# EAGLE design controller-terminals (EAGLE 5.04)
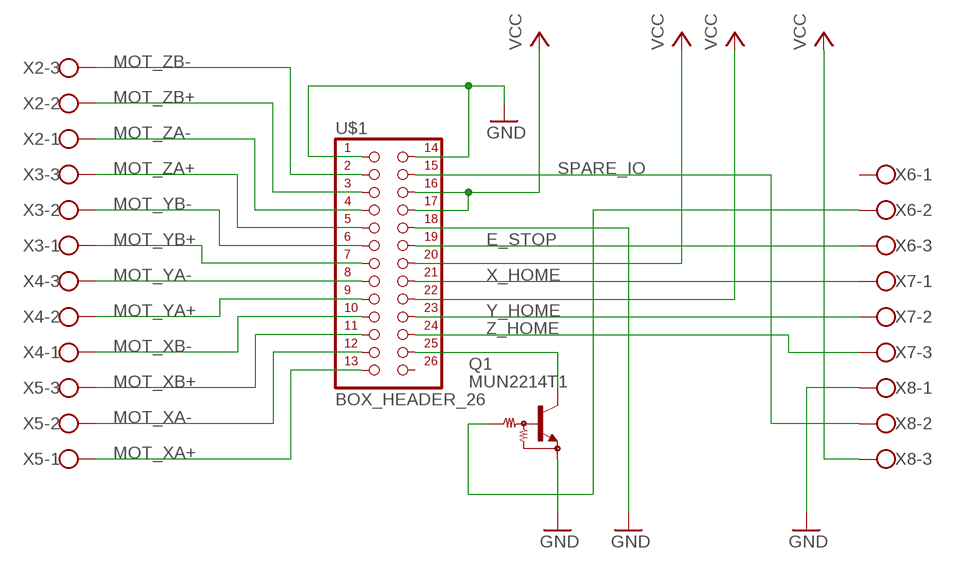
[diagram p0: schematic, sheet 1]

## Parts
Q1  MUN2214T1  [SC59-BEC]
U$1  BOX_HEADER_26  [BOX_HEADER_26]
X2  W237-03P  [W237-133]
X3  W237-03P  [W237-133]
X4  W237-03P  [W237-133]
X5  W237-03P  [W237-133]
X6  W237-03P  [W237-133]
X7  W237-03P  [W237-133]
X8  W237-03P  [W237-133]

## Nets
E_STOP: U$1.P$19 X6.3
GND: Q1.E U$1.P$1 U$1.P$14 U$1.P$18 X8.1
MOT_XA+: U$1.P$13 X5.1
MOT_XA-: U$1.P$12 X5.2
MOT_XB+: U$1.P$11 X5.3
MOT_XB-: U$1.P$10 X4.1
MOT_YA+: U$1.P$9 X4.2
MOT_YA-: U$1.P$8 X4.3
MOT_YB+: U$1.P$7 X3.1
MOT_YB-: U$1.P$6 X3.2
MOT_ZA+: U$1.P$5 X3.3
MOT_ZA-: U$1.P$4 X2.1
MOT_ZB+: U$1.P$3 X2.2
MOT_ZB-: U$1.P$2 X2.3
N$1: Q1.C U$1.P$25
N$2: Q1.B X6.2
SPARE_IO: U$1.P$15 X8.2
VCC: U$1.P$16 U$1.P$17 U$1.P$20 U$1.P$22 X8.3
X_HOME: U$1.P$21 X7.1
Y_HOME: U$1.P$23 X7.2
Z_HOME: U$1.P$24 X7.3
Unconnected: U$1.P$26 X6.1

## Library data of the parts
Q1 = transistor-npn:MUN2214*: NPN Bias Resistor Transistor
U$1 = box-headers:BOX_HEADER_26
X2-X8 = con-wago-508:W237-03P: WAGO SREW CLAMP

## Board
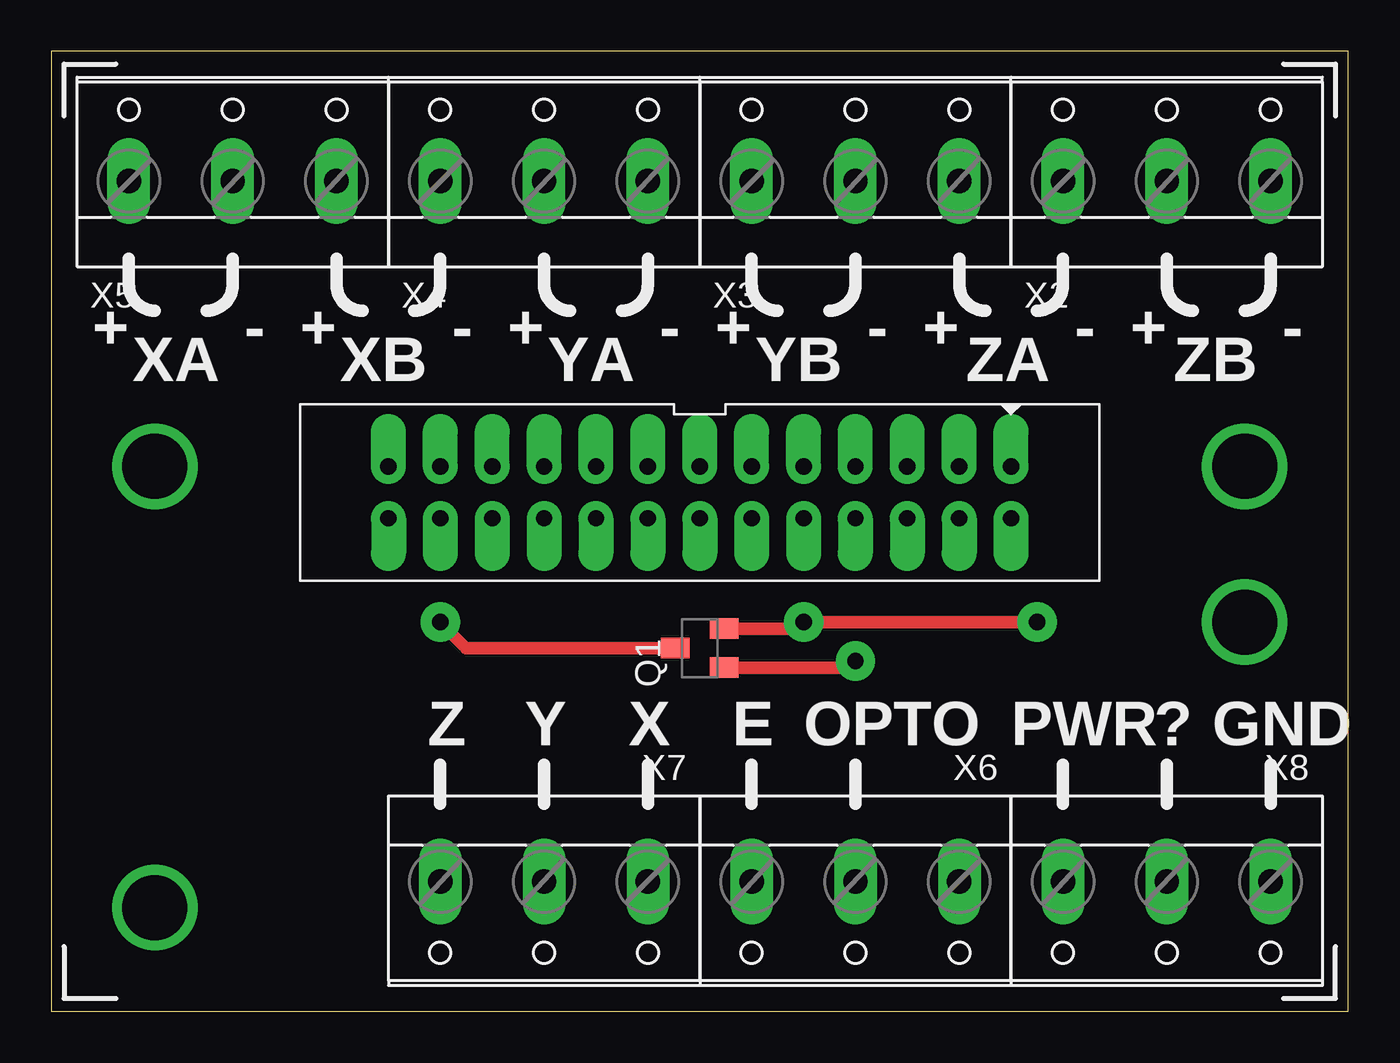
[diagram p1: board, top side]
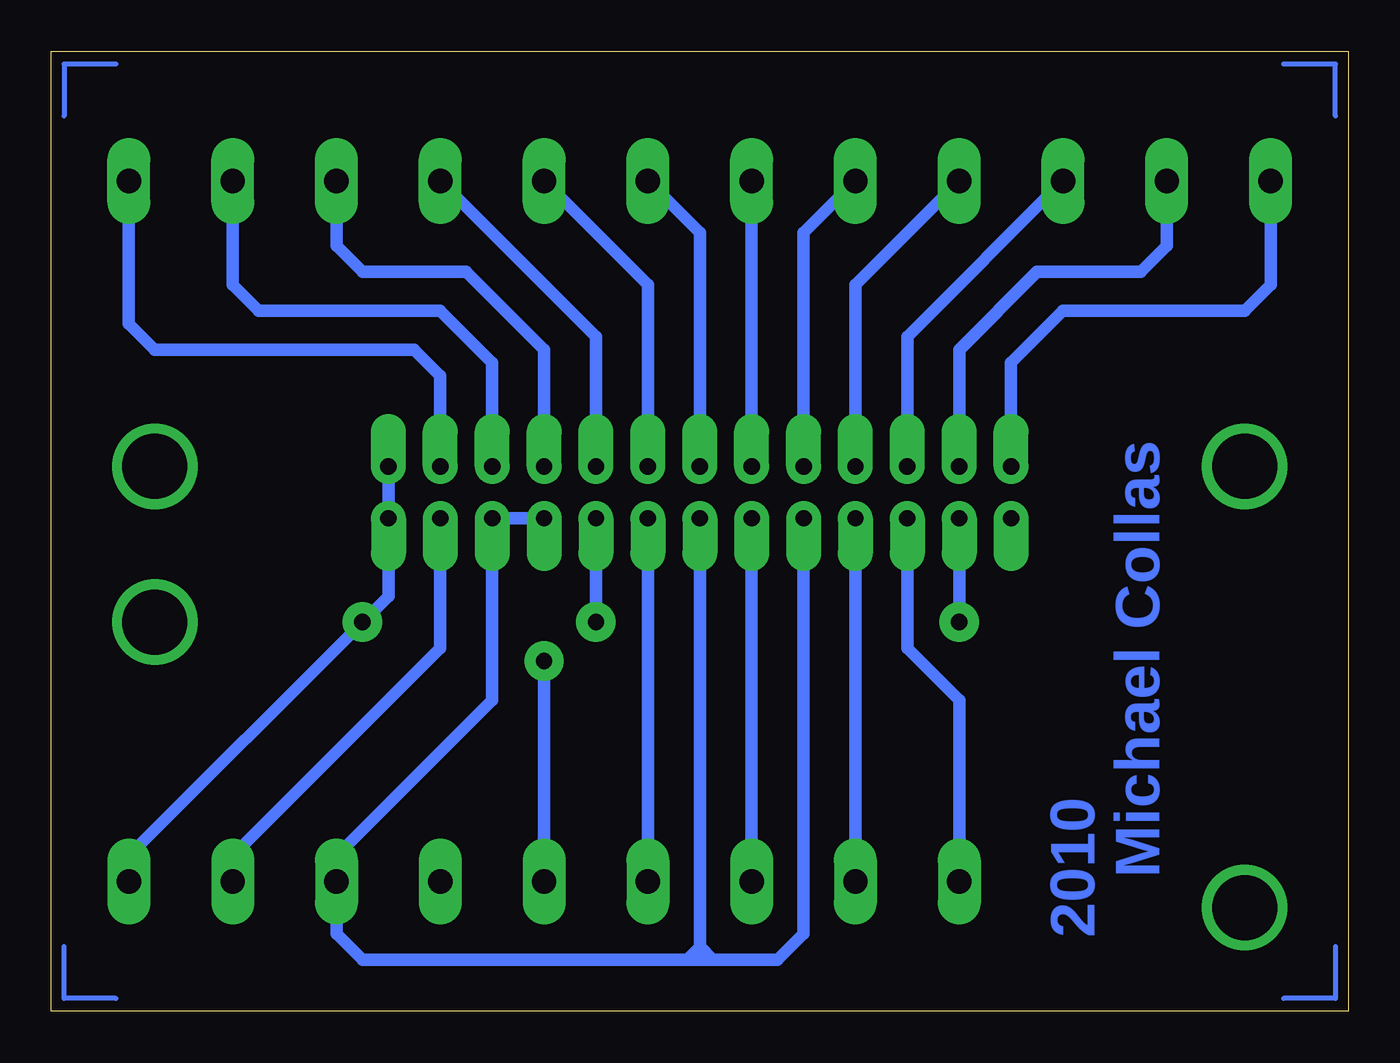
[diagram p2: board, bottom side, seen from below]

Size 63.5 x 46.99 mm. Coordinates in mm from the lower left corner, seen from the top.
Outline: 0,0 63.5,0 63.5,46.99 0,46.99 0,0
Copper layers (1*16): Top 0.035mm / dielectric 1.5mm / Bottom 0.035mm
Design rules "default *": minimum track width 12mil, minimum drill 24mil, track to track 18mil, track to pad 18mil, pad to pad 16mil, via to via 16mil, smd to smd 8mil, copper to edge 40mil, drill to drill 8mil, minimum pad ring 18mil, minimum via ring 8mil, stop-mask expansion 4mil, vias tented up to drill 0mil, thermal gap 10mil

### Footprints (pad centres in the part's own frame; a part is rotated, then mirrored left to right if it is on the bottom)
SC59-BEC = smd 1 x 1.4: B -0.95,-1.2; C 0,1.2; E 0.95,-1.2
BOX_HEADER_26 = drill 0.8 offset: P$1 15.24,1.27; P$2 12.7,1.27; P$3 10.16,1.27; P$4 7.62,1.27; P$5 5.08,1.27; P$6 2.54,1.27; P$7 0,1.27; P$8 -2.54,1.27; P$9 -5.08,1.27; P$10 -7.62,1.27; P$11 -10.16,1.27; P$12 -12.7,1.27; P$13 -15.24,1.27; P$14 15.24,-1.27; P$15 12.7,-1.27; P$16 10.16,-1.27; P$17 7.62,-1.27; P$18 5.08,-1.27; P$19 2.54,-1.27; P$20 0,-1.27; P$21 -2.54,-1.27; P$22 -5.08,-1.27; P$23 -7.62,-1.27; P$24 -10.16,-1.27; P$25 -12.7,-1.27; P$26 -15.24,-1.27
W237-133 = drill 1.194 long: 1 -5.08,-0.635; 2 0,-0.635; 3 5.08,-0.635

### Placement (x,y rotation side)
Q1  31.75,17.78 90 top
U$1  31.75,25.4 0 top
X2  54.61,41.27 0 top
X3  39.37,41.27 0 top
X4  24.13,41.27 0 top
X5  8.89,41.27 0 top
X6  39.37,5.71 180 top
X7  24.13,5.71 180 top
X8  54.61,5.71 180 top

### Tracks (layer width: path | path; a pad name or v marks a point on that pad's centre or on a via)
E_STOP
  Bottom 0.61: X6.3 U$1.P$19
GND  (via drill 0.8 pad 1.93)
  Top 0.61: Q1.E 36.51,18.73 v36.83,19.05 v48.26,19.05
  Bottom 0.61: U$1.P$1 U$1.P$14 46.99,20.32 v48.26,19.05 59.69,7.62 X8.1 | v36.83,19.05 U$1.P$18
MOT_XA+
  Bottom 0.61: U$1.P$13 16.51,31.75 13.97,34.29 5.08,34.29 3.81,35.56 X5.1
MOT_XA-
  Bottom 0.61: X5.2 8.89,37.46 10.16,36.2 15.24,36.2 19.05,32.38 U$1.P$12
MOT_XB+
  Bottom 0.61: U$1.P$11 21.59,33.02 X5.3
MOT_XB-
  Bottom 0.61: U$1.P$10 24.13,35.56 X4.1
MOT_YA+
  Bottom 0.61: U$1.P$9 26.67,38.1 X4.2
MOT_YA-
  Bottom 0.61: U$1.P$8 X4.3
MOT_YB+
  Bottom 0.61: U$1.P$7 31.75,38.1 X3.1
MOT_YB-
  Bottom 0.61: U$1.P$6 34.29,35.56 X3.2
MOT_ZA+
  Bottom 0.61: U$1.P$5 36.83,33.02 X3.3
MOT_ZA-
  Bottom 0.61: U$1.P$4 39.37,32.38 43.18,36.2 48.26,36.2 49.53,37.46 X2.1
MOT_ZB+
  Bottom 0.61: U$1.P$3 41.91,31.75 44.45,34.29 53.34,34.29 54.61,35.56 X2.2
MOT_ZB-
  Bottom 0.61: U$1.P$2 44.45,31.12 45.72,32.38 58.42,32.38 59.69,33.66 X2.3
N$1  (via drill 0.8 pad 1.93)
  Top 0.61: v19.05,19.05 20.32,17.78 Q1.C
  Bottom 0.61: v19.05,19.05 U$1.P$25
N$2  (via drill 0.8 pad 1.93)
  Top 0.61: Q1.B 39.06,16.83 v39.37,17.15
  Bottom 0.61: X6.2 v39.37,17.15
N$3  (via drill 3.17)
  other vias: 5.08,5.08 5.08,26.67 58.42,26.67 58.42,19.05
N$4
  Bottom 0.254: 0.64,43.81 0.64,46.35 3.18,46.35
N$5
  Bottom 0.254: 60.33,46.35 62.86,46.35 62.86,43.81
N$6
  Bottom 0.254: 60.33,0.64 62.86,0.64 62.86,3.18
N$7
  Bottom 0.254: 0.64,3.18 0.64,0.64 3.18,0.64
SPARE_IO
  Bottom 0.61: U$1.P$15 44.45,17.78 54.61,7.62 X8.2
VCC
  Bottom 0.61: U$1.P$17 U$1.P$16 41.91,15.24 49.53,7.62 X8.3 49.53,3.81 48.26,2.54 32.39,2.54 | U$1.P$22 26.67,3.81 27.94,2.54 31.11,2.54 | 31.11,2.54 31.75,2.54 | 31.75,2.54 32.39,2.54 | 31.75,2.54 31.75,3.18 | 31.75,3.18 U$1.P$20 | 31.11,2.54 31.75,3.18 | 31.75,3.18 32.39,2.54
X_HOME
  Bottom 0.61: X7.1 U$1.P$21
Y_HOME
  Bottom 0.61: X7.2 U$1.P$23
Z_HOME
  Bottom 0.61: U$1.P$24 21.59,17.78 19.05,15.24 X7.3

### Text on the board
Bottom: Michael Collas | 2010
tSilk: + | - | + | - | + | - | + | - | + | - | + | - | XA | XB | YA | YB | ZA | ZB | Z | Y | X | E | OPTO | PWR | ? | GND